# EAGLE design targetboard3 (EAGLE 6.5.0)
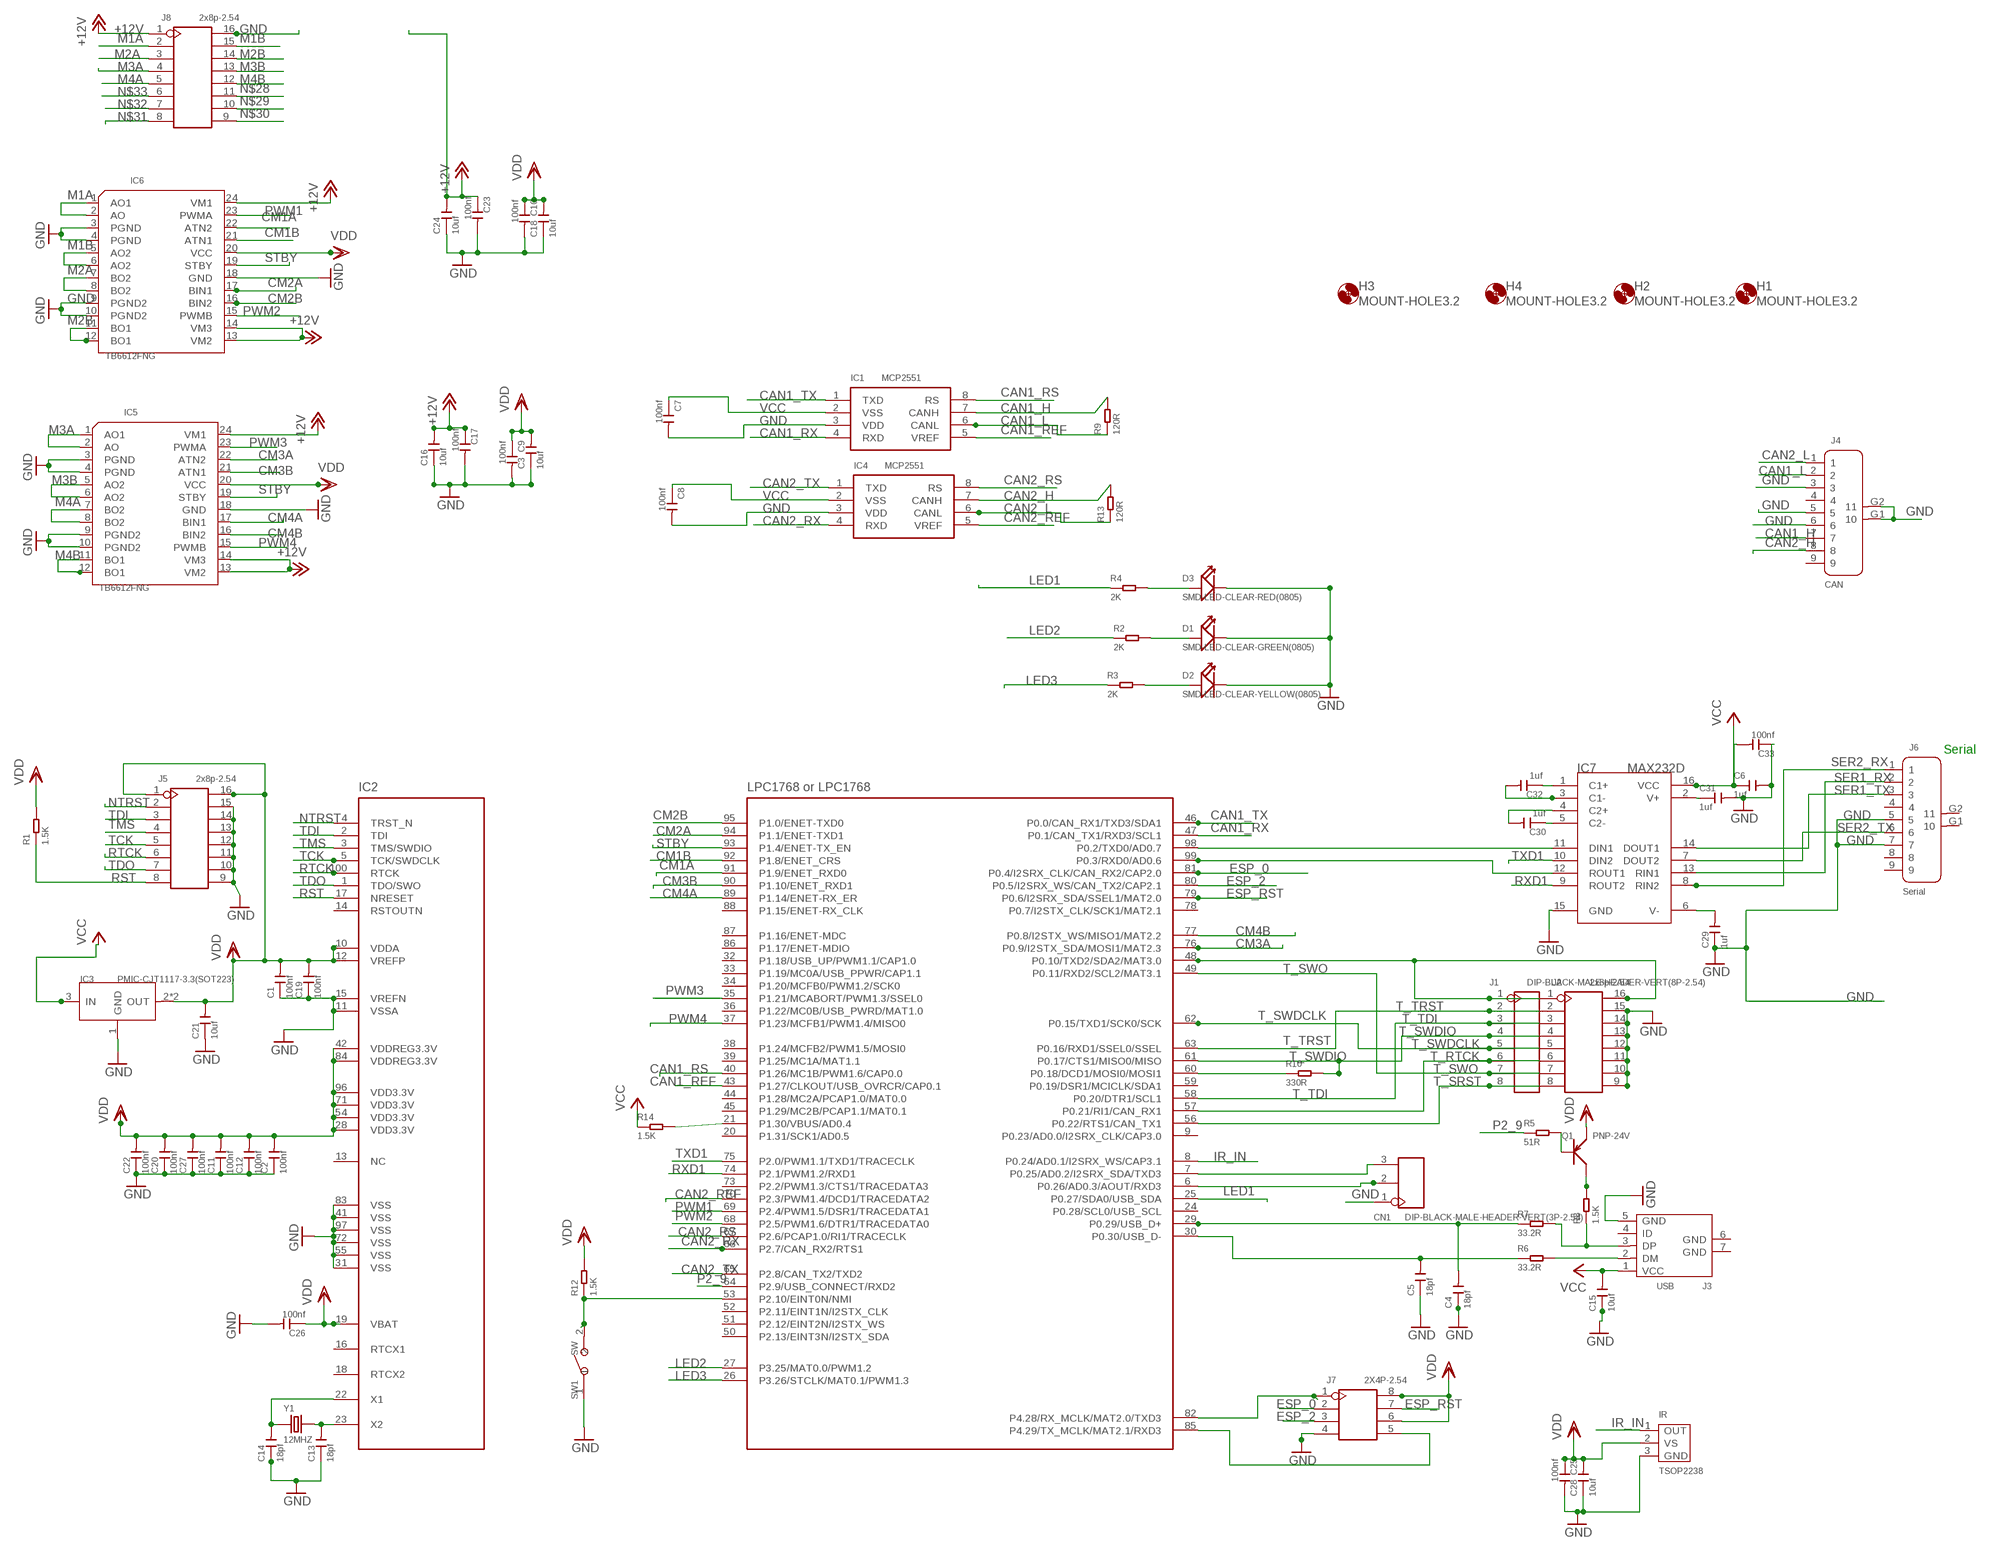
[diagram p0: schematic, sheet 1]

## Parts
C1  100nf  CERAMIC-100NF-50V-10%-X7R(0805)  [C0805]
C2  100nf  CERAMIC-100NF-50V-10%-X7R(0805)  [C0805]
C3  10uf  CERAMIC-10UF-25V-10%-X5R(0805)  [C0805]
C4  18pf  CERAMIC-18PF-50V-5%-NPO(0805)  [C0805]
C5  18pf  CERAMIC-18PF-50V-5%-NPO(0805)  [C0805]
C6  1uf  CERAMIC-1UF-25V-10%-X7R(0805)  [C0805]
C7  100nf  CERAMIC-100NF-50V-10%-X7R(0805)  [C0805]
C8  100nf  CERAMIC-100NF-50V-10%-X7R(0805)  [C0805]
C9  100nf  CERAMIC-100NF-50V-10%-X7R(0805)  [C0805]
C10  100nf  CERAMIC-100NF-50V-10%-X7R(0805)  [C0805]
C11  100nf  CERAMIC-100NF-50V-10%-X7R(0805)  [C0805]
C12  100nf  CERAMIC-100NF-50V-10%-X7R(0805)  [C0805]
C13  18pf  CERAMIC-18PF-50V-5%-NPO(0805)  [C0805]
C14  18pf  CERAMIC-18PF-50V-5%-NPO(0805)  [C0805]
C15  10uf  CERAMIC-10UF-10V-10%-X5R(0603)  [C0603]
C16  10uf  CERAMIC-10UF-25V-10%-X5R(0805)  [C0805]
C17  100nf  CERAMIC-100NF-50V-10%-X7R(0805)  [C0805]
C18  10uf  CERAMIC-10UF-25V-10%-X5R(0805)  [C0805]
C19  100nf  CERAMIC-100NF-50V-10%-X7R(0805)  [C0805]
C20  100nf  CERAMIC-100NF-50V-10%-X7R(0805)  [C0805]
C21  10uf  CERAMIC-10UF-25V-10%-X5R(0805)  [C0805]
C22  100nf  CERAMIC-100NF-50V-10%-X7R(0805)  [C0805]
C23  100nf  CERAMIC-100NF-50V-10%-X7R(0805)  [C0805]
C24  10uf  CERAMIC-10UF-25V-10%-X5R(0805)  [C0805]
C25  100nf  CERAMIC-100NF-50V-10%-X7R(0805)  [C0805]
C26  100nf  CERAMIC-100NF-50V-10%-X7R(0805)  [C0805]
C27  100nf  CERAMIC-100NF-50V-10%-X7R(0805)  [C0805]
C28  10uf  CERAMIC-10UF-25V-10%-X5R(0805)  [C0805]
C29  1uf  CERAMIC-1UF-25V-10%-X7R(0805)  [C0805]
C30  1uf  CERAMIC-1UF-25V-10%-X7R(0805)  [C0805]
C31  1uf  CERAMIC-1UF-25V-10%-X7R(0805)  [C0805]
C32  1uf  CERAMIC-1UF-25V-10%-X7R(0805)  [C0805]
C33  100nf  CERAMIC-100NF-50V-10%-X7R(0805)  [C0805]
CN1  DIP-BLACK-MALE-HEADER-VERT(3P-2.54)  [H3-2.54]
D1  SMD-LED-CLEAR-GREEN(0805)  [LED-0805]
D2  SMD-LED-CLEAR-YELLOW(0805)  [LED-0805]
D3  SMD-LED-CLEAR-RED(0805)  [LED-0805]
H1  MOUNT-HOLE3.2  [3,2]
H2  MOUNT-HOLE3.2  [3,2]
H3  MOUNT-HOLE3.2  [3,2]
H4  MOUNT-HOLE3.2  [3,2]
IC1  MCP2551  INTERFACE-MCP2551-I/SN(SOIC8)  [SOIC8-1.27-5X4MM]
IC2  LPC1768 or LPC1768  MCU_LPC1768FBD100(LQFP100)  [LQFP100-0.5-13.8X13.8MM]
IC3  PMIC-CJT1117-3.3(SOT223)  [SOT-223]
IC4  MCP2551  INTERFACE-MCP2551-I/SN(SOIC8)  [SOIC8-1.27-5X4MM]
IC5  TB6612FNG  DRIVER-TB6612FNG-O/C8/EL(SSOP24)  [SSOP24-0.65-8.9X5.3MM]
IC6  TB6612FNG  DRIVER-TB6612FNG-O/C8/EL(SSOP24)  [SSOP24-0.65-8.9X5.3MM]
IC7  MAX232D  RECEIVER-MAX232D(SOIC16)  [SOIC16-1.27-10X3.9MM]
IR  TSOP2238  OPTICAL-TSOP2238  [SNR3-2.54-6.95X6.0X5.6MM]
J1  DIP-BLACK-MALE-HEADER-VERT(8P-2.54)  [H8-2.54]
J2  2x8p-2.54  DIP-BLACK-MALE-HEADER-VERT(2X8P-2.54)  [H2X8-2.54]
J3  USB  MICRO-USB-SMD-TYPE-AB-R/A(ST-USB-001L)  [MICRO-USB5+2P-SMD-0.65]
J4  CAN  DIP-MALE-DB9-CONNECTOR  [DSUB9+2P-2.77-90D-MALE]
J5  2x8p-2.54  DIP-BLACK-MALE-HEADER-VERT(2X8P-2.54)  [H2X8-2.54]
J6  Serial  DIP-MALE-DB9-CONNECTOR  [DSUB9+2P-2.77-90D-MALE]
J7  2X4P-2.54  DIP-BLACK-FEMALE-HEADER(2X4P-2.54)  [H2X4-2.54]
J8  2x8p-2.54  DIP-BLACK-MALE-HEADER-VERT(2X8P-2.54)  [H2X8-2.54]
Q1  PNP-24V  SMD-TRANSISTORS-PNP-25V-500MA(SOT-23)  [SOT-23]
R1  1.5K  SMD-RES-1.5K-1%-1/8W(0805)  [R0805]
R2  2K  SMD-RES-2K-5%-1/8W(0805)  [R0805]
R3  2K  SMD-RES-2K-5%-1/8W(0805)  [R0805]
R4  2K  SMD-RES-2K-5%-1/8W(0805)  [R0805]
R5  51R  SMD-RES-51R-1%-1/10W(0603)  [R0603]
R6  33.2R  SMD-RES-33.2R-1%-1/10W(0603)  [R0603]
R7  33.2R  SMD-RES-33.2R-1%-1/10W(0603)  [R0603]
R8  1.5K  SMD-RES-1.5K-1%-1/8W(0805)  [R0805]
R9  120R  SMD-RES-120R-5%-1/8W(0805)  [R0805]
R10  330R  SMD-RES-330R-1%-1/10W(0603)  [R0603]
R12  1.5K  SMD-RES-1.5K-1%-1/8W(0805)  [R0805]
R13  120R  SMD-RES-120R-5%-1/8W(0805)  [R0805]
R14  1.5K  SMD-RES-1.5K-1%-1/8W(0805)  [R0805]
SW1  SW  SMD-BUTTON(2P-3.0X2.5X1.2+0.4MM)-B3U-1000P-2P-SMD  [SW2-2.6-3.0X2.5X1.2+0.4MM]
Y1  12MHZ  SMD-CRYSTAL-12MHZ-20PF-20PPM-40R(2P-5.0X3.2MM)  [X2-SMD-5.0X3.2X1.3MM]

## Nets
+12V: C16.2 C17.1 C23.1 C24.2 IC5.13(VM2) IC5.14(VM3) IC5.24(VM1) IC6.13(VM2) IC6.14(VM3) IC6.24(VM1) J8.1
CAN1_H: IC1.7(CANH) J4.7 R9.2
CAN1_L: IC1.6(CANL) J4.2 R9.1
CAN1_REF: IC1.5(VREF) IC2.43(P1.27/CLKOUT/USB_OVRCR/CAP0.1)
CAN1_RS: IC1.8(RS) IC2.40(P1.26/MC1B/PWM1.6/CAP0.0)
CAN1_RX: IC1.4(RXD) IC2.47(P0.1/CAN_TX1/RXD3/SCL1)
CAN1_TX: IC1.1(TXD) IC2.46(P0.0/CAN_RX1/TXD3/SDA1)
CAN2_H: IC4.7(CANH) J4.8 R13.2
CAN2_L: IC4.6(CANL) J4.1 R13.1
CAN2_REF: IC2.70(P2.3/PWM1.4/DCD1/TRACEDATA2) IC4.5(VREF)
CAN2_RS: IC2.67(P2.6/PCAP1.0/RI1/TRACECLK) IC4.8(RS)
CAN2_RX: IC2.66(P2.7/CAN_RX2/RTS1) IC4.4(RXD)
CAN2_TX: IC2.65(P2.8/CAN_TX2/TXD2) IC4.1(TXD)
CM1A: IC2.91(P1.9/ENET_RXD0) IC6.22(ATN2)
CM1B: IC2.92(P1.8/ENET_CRS) IC6.21(ATN1)
CM2A: IC2.94(P1.1/ENET-TXD1) IC6.17(BIN1)
CM2B: IC2.95(P1.0/ENET-TXD0) IC6.16(BIN2)
CM3A: IC2.76(P0.9/I2STX_SDA/MOSI1/MAT2.3) IC5.22(ATN2)
CM3B: IC2.90(P1.10/ENET_RXD1) IC5.21(ATN1)
CM4A: IC2.89(P1.14/ENET-RX_ER) IC5.17(BIN1)
CM4B: IC2.77(P0.8/I2STX_WS/MISO1/MAT2.2) IC5.16(BIN2)
DM: J3.2(DM) R6.2
DP: J3.3(DP) R7.2 R8.1
EDM: C5.2 IC2.30(P0.30/USB_D-) R6.1
EDP: C4.2 IC2.29(P0.29/USB_D+) R7.1
ESP_0: IC2.81(P0.4/I2SRX_CLK/CAN_RX2/CAP2.0) J7.2
ESP_2: IC2.80(P0.5/I2SRX_WS/CAN_TX2/CAP2.1) J7.3
ESP_RST: IC2.79(P0.6/I2SRX_SDA/SSEL1/MAT2.0) J7.7
GND: C1.1 C2.1 C3.1 C4.1 C5.1 C6.2 C7.2 C8.2 C9.2 C10.2 C11.1 C12.1 C13.1 C14.1 C15.1 C16.1 C17.2 C18.1 C19.1 C20.1 C21.1 C22.1 C23.2 C24.1 C25.2 C26.2 C27.1 C28.1 C29.1 C31.2 C33.1 CN1.1 D1.- D2.- D3.- IC1.3(VDD) IC2.11(VSSA) IC2.15(VREFN) IC2.31(VSS) IC2.41(VSS) IC2.55(VSS) IC2.72(VSS) IC2.83(VSS) IC2.97(VSS) IC3.1(GND) IC4.3(VDD) IC5.3(PGND) IC5.4(PGND) IC5.9(PGND2) IC5.10(PGND2) IC5.18(GND) IC6.3(PGND) IC6.4(PGND) IC6.9(PGND2) IC6.10(PGND2) IC6.18(GND) IC7.15(GND) IR.3(GND) J2.9 J2.10 J2.11 J2.12 J2.13 J2.14 J2.15 J3.5(GND) J4.3 J4.5 J4.6 J4.G1 J4.G2 J5.9 J5.10 J5.11 J5.12 J5.13 J5.14 J5.15 J6.5 J6.7 J7.4 J8.16 SW1.1
IR_IN: IC2.8(P0.24/AD0.1/I2SRX_WS/CAP3.1) IR.1(OUT)
LED1: IC2.25(P0.27/SDA0/USB_SDA) R4.1
LED2: IC2.27(P3.25/MAT0.0/PWM1.2) R2.1
LED3: IC2.26(P3.26/STCLK/MAT0.1/PWM1.3) R3.1
M1A: IC6.1(AO1) IC6.2(AO) J8.2
M1B: IC6.5(AO2) IC6.6(AO2) J8.15
M2A: IC6.7(BO2) IC6.8(BO2) J8.3
M2B: IC6.11(BO1) IC6.12(BO1) J8.14
M3A: IC5.1(AO1) IC5.2(AO) J8.4
M3B: IC5.5(AO2) IC5.6(AO2) J8.13
M4A: IC5.7(BO2) IC5.8(BO2) J8.5
M4B: IC5.11(BO1) IC5.12(BO1) J8.12
N$1: IC2.48(P0.10/TXD2/SDA2/MAT3.0) J1.1 J2.1 J2.16
N$2: IC2.53(P2.10/EINT0N/NMI) R12.1 SW1.2
N$3: D2.+ R3.2
N$4: D1.+ R2.2
N$5: D3.+ R4.2
N$6: C14.2 IC2.22(X1) Y1.1
N$7: Q1.3(C) R8.2
N$8: C13.2 IC2.23(X2) Y1.2
N$9: Q1.1(B) R5.2
N$10: IC2.21(P1.30/VBUS/AD0.4) R14.2
N$11: IC2.85(P4.29/TX_MCLK/MAT2.1/RXD3) J7.5
N$12: IC2.98(P0.2/TXD0/AD0.7) IC7.11(DIN1)
N$13: IC2.99(P0.3/RXD0/AD0.6) IC7.12(ROUT1)
N$15: C30.2 IC7.4(C2+)
N$16: C30.1 IC7.5(C2-)
N$17: C32.1 IC7.1(C1+)
N$18: C32.2 IC7.3(C1-)
N$19: C29.2 IC7.6(V-)
N$20: C31.1 IC7.2(V+)
N$22: IC2.60(P0.18/DCD1/MOSI0/MOSI1) R10.1
N$23: IC2.82(P4.28/RX_MCLK/MAT2.0/TXD3) J7.1
N$28: J8.11
N$29: J8.10
N$30: J8.9
N$31: J8.8
N$32: J8.7
N$33: J8.6
NTRST: IC2.4(TRST_N) J5.2
P2_9: IC2.64(P2.9/USB_CONNECT/RXD2) R5.1
PWM1: IC2.69(P2.4/PWM1.5/DSR1/TRACEDATA1) IC6.23(PWMA)
PWM2: IC2.68(P2.5/PWM1.6/DTR1/TRACEDATA0) IC6.15(PWMB)
PWM3: IC2.35(P1.21/MCABORT/PWM1.3/SSEL0) IC5.23(PWMA)
PWM4: IC2.37(P1.23/MCFB1/PWM1.4/MISO0) IC5.15(PWMB)
RST: IC2.17(NRESET) J5.8 R1.1
RTCK: IC2.100(RTCK) J5.6
RX3: CN1.2 IC2.6(P0.26/AD0.3/AOUT/RXD3)
RXD1: IC2.74(P2.1/PWM1.2/RXD1) IC7.9(ROUT2)
SER1_RX: IC7.13(RIN1) J6.2
SER1_TX: IC7.14(DOUT1) J6.3
SER2_RX: IC7.8(RIN2) J6.1
SER2_TX: IC7.7(DOUT2) J6.6
STBY: IC2.93(P1.4/ENET-TX_EN) IC5.19(STBY) IC6.19(STBY)
T_RTCK: IC2.57(P0.21/RI1/CAN_RX1) J1.6 J2.6
T_SRST: IC2.56(P0.22/RTS1/CAN_TX1) J1.8 J2.8
T_SWDCLK: IC2.62(P0.15/TXD1/SCK0/SCK) J1.5 J2.5
T_SWDIO: IC2.61(P0.17/CTS1/MISO0/MISO) J1.4 J2.4 R10.2
T_SWO: IC2.49(P0.11/RXD2/SCL2/MAT3.1) J1.7 J2.7
T_TDI: IC2.58(P0.20/DTR1/SCL1) J1.3 J2.3
T_TRST: IC2.63(P0.16/RXD1/SSEL0/SSEL) J1.2 J2.2
TCK: IC2.5(TCK/SWDCLK) J5.5
TDI: IC2.2(TDI) J5.3
TDO: IC2.1(TDO/SWO) J5.7
TMS: IC2.3(TMS/SWDIO) J5.4
TX3: CN1.3 IC2.7(P0.25/AD0.2/I2SRX_SDA/TXD3)
TXD1: IC2.75(P2.0/PWM1.1/TXD1/TRACECLK) IC7.10(DIN2)
VCC: C6.1 C7.1 C8.1 C15.2 C33.2 IC1.2(VSS) IC3.3(IN) IC4.2(VSS) IC7.16(VCC) J3.1(VCC) R14.1
VDD: C1.2 C2.2 C3.2 C9.1 C10.1 C11.2 C12.2 C18.2 C19.2 C20.2 C21.2 C22.2 C25.1 C26.1 C27.2 C28.2 IC2.10(VDDA) IC2.12(VREFP) IC2.19(VBAT) IC2.28(VDD3.3V) IC2.42(VDDREG3.3V) IC2.54(VDD3.3V) IC2.71(VDD3.3V) IC2.84(VDDREG3.3V) IC2.96(VDD3.3V) IC3.2(OUT) IC3.TER(OUT) IC5.20(VCC) IC6.20(VCC) IR.2(VS) J5.1 J5.16 J7.6 J7.8 Q1.2(E) R1.2 R12.2
Unconnected: IC2.9(P0.23/AD0.0/I2SRX_CLK/CAP3.0) IC2.13(NC) IC2.14(RSTOUTN) IC2.16(RTCX1) IC2.18(RTCX2) IC2.20(P1.31/SCK1/AD0.5) IC2.24(P0.28/SCL0/USB_SCL) IC2.32(P1.18/USB_UP/PWM1.1/CAP1.0) IC2.33(P1.19/MC0A/USB_PPWR/CAP1.1) IC2.34(P1.20/MCFB0/PWM1.2/SCK0) IC2.36(P1.22/MC0B/USB_PWRD/MAT1.0) IC2.38(P1.24/MCFB2/PWM1.5/MOSI0) IC2.39(P1.25/MC1A/MAT1.1) IC2.44(P1.28/MC2A/PCAP1.0/MAT0.0) IC2.45(P1.29/MC2B/PCAP1.1/MAT0.1) IC2.50(P2.13/EINT3N/I2STX_SDA) IC2.51(P2.12/EINT2N/I2STX_WS) IC2.52(P2.11/EINT1N/I2STX_CLK) IC2.59(P0.19/DSR1/MCICLK/SDA1) IC2.73(P2.2/PWM1.3/CTS1/TRACEDATA3) IC2.78(P0.7/I2STX_CLK/SCK1/MAT2.1) IC2.86(P1.17/ENET-MDIO) IC2.87(P1.16/ENET-MDC) IC2.88(P1.15/ENET-RX_CLK) J3.4(ID) J3.6(GND) J3.7(GND) J4.4 J4.9 J6.4 J6.8 J6.9 J6.G1 J6.G2

## Notes on the sheet
- Serial

## Library data of the parts
C1 C2 C7-C12 C17 C19 C20 C22 C23 C25-C27 C33 = Seeed-OPL-Capacitor:CERAMIC-100NF-50V-10%-X7R(0805): 302010165; MPN: CC0805KRX7R9BB104
C3 C16 C18 C21 C24 C28 = Seeed-OPL-Capacitor:CERAMIC-10UF-25V-10%-X5R(0805): 302010178; MPN: CC0805KKX5R8BB106
C4 C5 C13 C14 = Seeed-OPL-Capacitor:CERAMIC-18PF-50V-5%-NPO(0805): 302010162
C6 C29-C32 = Seeed-OPL-Capacitor:CERAMIC-1UF-25V-10%-X7R(0805): 302010179; MPN: CC0805KKX7R8BB105
C15 = Seeed-OPL-Capacitor:CERAMIC-10UF-10V-10%-X5R(0603): 302010103; MPN: CC0603KRX5R6BB106
CN1 = Seeed-OPL-Connector:DIP-BLACK-MALE-HEADER-VERT(3P-2.54): 320020079
D1 = Seeed-OPL-Diode:SMD-LED-CLEAR-GREEN(0805): 304090057; MPN: 17-215SYGC/S530-E2/TR8
D2 = Seeed-OPL-Diode:SMD-LED-CLEAR-YELLOW(0805): 304090039; MPN: 17-215UYC/S530-A3/TR8
D3 = Seeed-OPL-Diode:SMD-LED-CLEAR-RED(0805): 304090046; MPN: 17-215SURC/S530-A2/TR8
H1-H4 = holes:MOUNT-HOLE: MOUNTING HOLE with drill center marker
IC1 IC4 = Seeed-OPL-ic:INTERFACE-MCP2551-I/SN(SOIC8): 310070024; MPN: MCP2551-I/SN
IC2 = Seeed-OPL-ic:MCU_LPC1768FBD100(LQFP100): 310010001; MPN: LPC1768FBD100
IC3 = Seeed-OPL-ic:PMIC-CJT1117-3.3(SOT223): 310030097; MPN: CJT1117-3.3
IC5 IC6 = Seeed-OPL-ic:DRIVER-TB6612FNG-O/C8/EL(SSOP24): 310040007; MPN: TB6612FNG-O/C8/EL
IC7 = Seeed-OPL-ic:RECEIVER-MAX232D(SOIC16): 310060023; MPN: MAX232D
IR = Seeed-OPL-sensor:OPTICAL-TSOP2238: 314020045
J1 = Seeed-OPL-Connector:DIP-BLACK-MALE-HEADER-VERT(8P-2.54): 320020080; MPN: P125-1108A1BS116A1
J2 J5 J8 = Seeed-OPL-Connector:DIP-BLACK-MALE-HEADER-VERT(2X8P-2.54): 320020045; MPN: P125-1216A0AS116A1
J3 = Seeed-OPL-Connector:MICRO-USB-SMD-TYPE-AB-R/A(ST-USB-001L): 320010012; MPN: ST-USB-001L
J4 J6 = Seeed-OPL-Connector:DIP-MALE-DB9-CONNECTOR: 320110017
J7 = Seeed-OPL-Connector:DIP-BLACK-FEMALE-HEADER(2X4P-2.54): 320030087
Q1 = Seeed-OPL-Transistor:SMD-TRANSISTORS-PNP-25V-500MA(SOT-23): 305020006; MPN: S8550
R1 R8 R12 R14 = Seeed-OPL-Resistor:SMD-RES-1.5K-1%-1/8W(0805): 301010394; MPN: RC0805FR-071K5L
R2-R4 = Seeed-OPL-Resistor:SMD-RES-2K-5%-1/8W(0805): 301010318; MPN: RC0805JR-072KL
R5 = Seeed-OPL-Resistor:SMD-RES-51R-1%-1/10W(0603): 301010225; MPN: RC0603FR-0751RL
R6 R7 = Seeed-OPL-Resistor:SMD-RES-33.2R-1%-1/10W(0603): 301010687; MPN: RC0603FR-0733R2L
R9 R13 = Seeed-OPL-Resistor:SMD-RES-120R-5%-1/8W(0805): 301010351; MPN: RC0805JR-07120RL
R10 = Seeed-OPL-Resistor:SMD-RES-330R-1%-1/10W(0603): 301010300; MPN: RC0603FR-07330RL
SW1 = Seeed-OPL-Switch:SMD-BUTTON(2P-3.0X2.5X1.2+0.4MM): 311020047
Y1 = Seeed-OPL-crystal-osctllator:SMD-CRYSTAL-12MHZ-20PF-20PPM-40R(2P-5.0X3.2MM): 306010047; MPN: 5032/2P

## Board
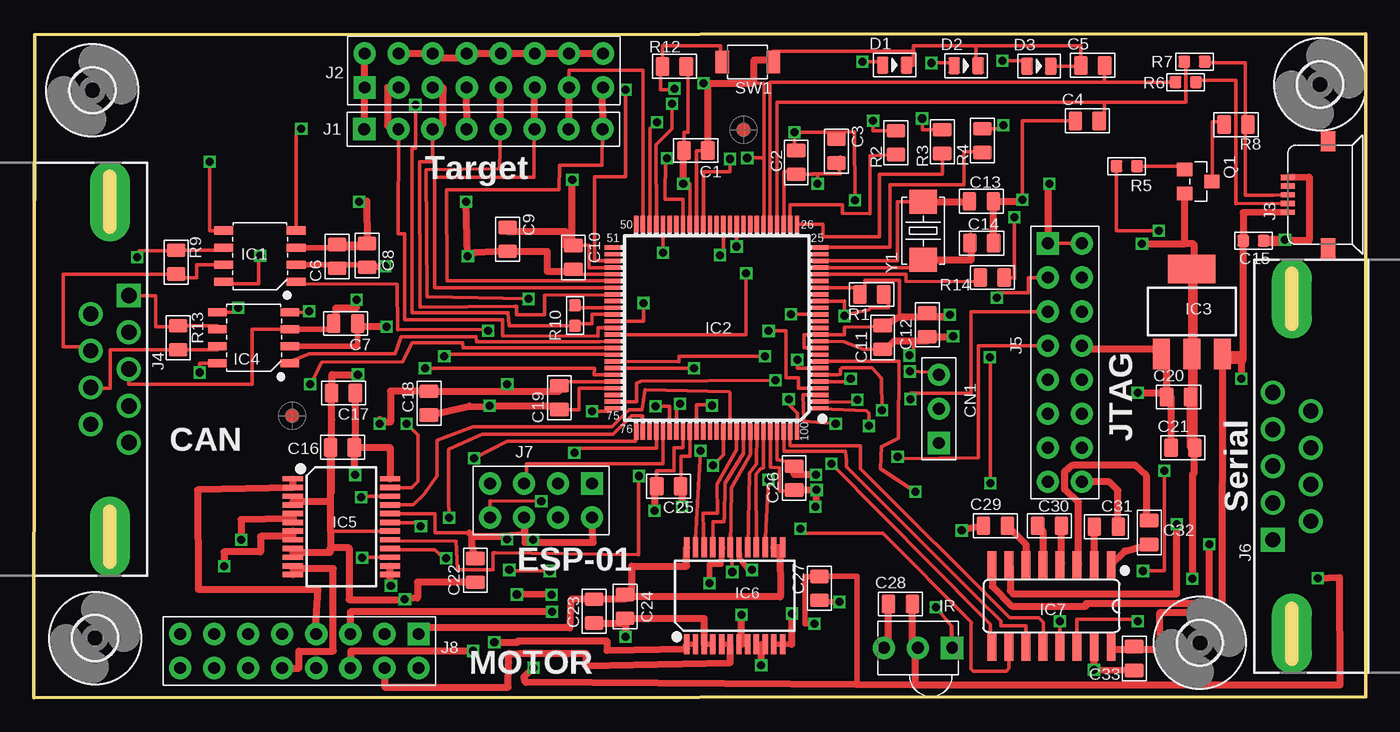
[diagram p1: board, top side]
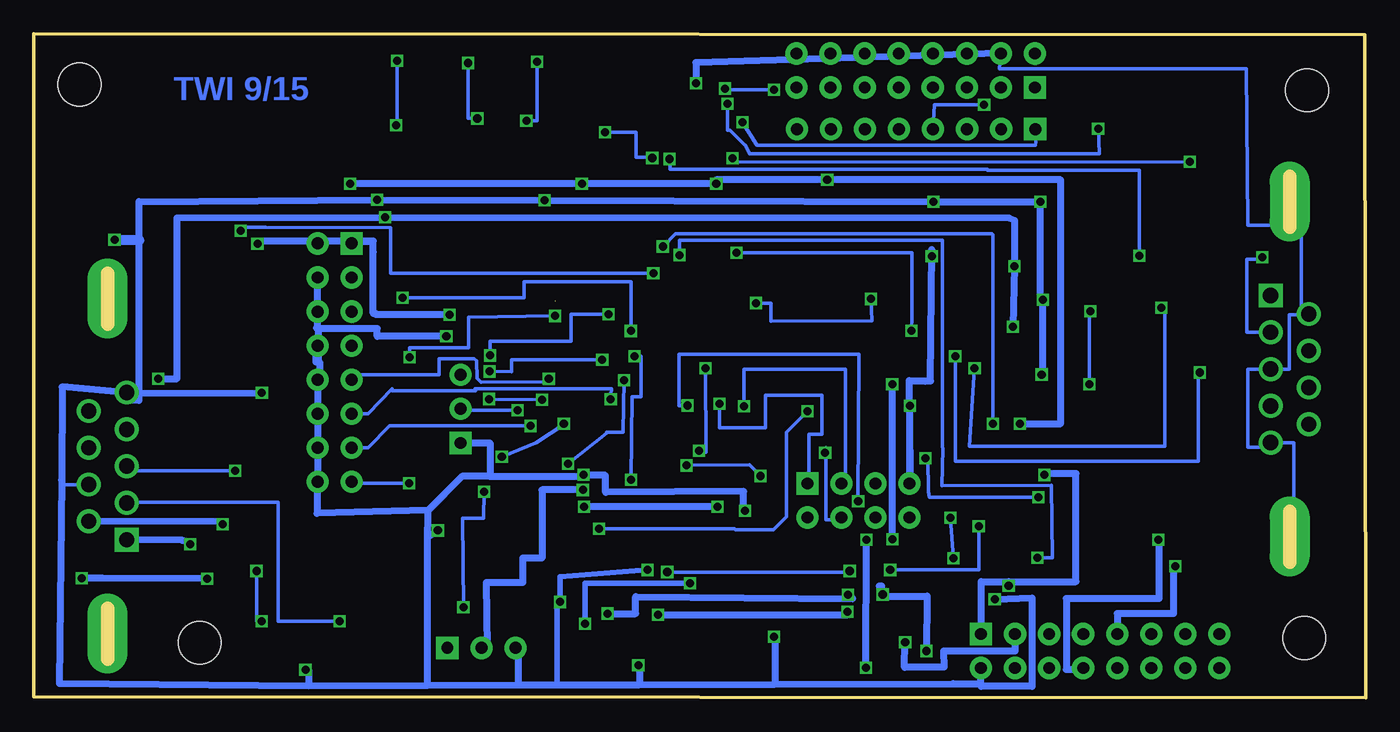
[diagram p2: board, bottom side, seen from below]

Size 99.44 x 49.57 mm. Coordinates in mm from the lower left corner, seen from the top.
Outline: 0,0 99.44,0.08 99.44,49.57 0.1,49.47 0,0
Copper layers (1*16): Top 0.035mm / dielectric 1.5mm / Bottom 0.035mm
Design rules "SeeedStudio_2layer_DRU_no_angle_20140221 *": minimum track width 6mil, minimum drill 12mil, track to track 7mil, track to pad 7mil, pad to pad 7mil, via to via 7mil, smd to smd 0mil, copper to edge 10mil, drill to drill 10mil, minimum pad ring 10mil, minimum via ring 6mil, stop-mask expansion 2mil, vias tented up to drill 100mil, thermal gap 10mil

### Footprints (pad centres in the part's own frame; a part is rotated, then mirrored left to right if it is on the bottom)
C0805 = smd 1.397 x 1.016: 1 0,0.889; 2 0,-0.889
C0603 = smd 0.889 x 0.889: 1 0,0.762; 2 0,-0.762
H3-2.54 = drill 0.889 pad 1.651 square: 1 0,2.54 | drill 0.889 pad 1.651: 2 0,0; 3 0,-2.54
LED-0805 = smd 0.889 x 1.27: + -0.889,0; - 0.889,0
3,2 = hole 3.2: 0,0
SOIC8-1.27-5X4MM = smd 0.6 x 1.4: 1 -1.905,-2.7; 2 -0.635,-2.7; 3 0.635,-2.7; 4 1.905,-2.7; 5 1.905,2.7; 6 0.635,2.7; 7 -0.635,2.7; 8 -1.905,2.7
LQFP100-0.5-13.8X13.8MM = smd 1.2 x 0.32: 1 -7.75,6; 2 -7.75,5.5; 3 -7.75,5; 4 -7.75,4.5; 5 -7.75,4; 6 -7.75,3.5; 7 -7.75,3; 8 -7.75,2.5; 9 -7.75,2; 10 -7.75,1.5; 11 -7.75,1; 12 -7.75,0.5; 13 -7.75,0; 14 -7.75,-0.5; 15 -7.75,-1; 16 -7.75,-1.5; 17 -7.75,-2; 18 -7.75,-2.5; 19 -7.75,-3; 20 -7.75,-3.5; 21 -7.75,-4; 22 -7.75,-4.5; 23 -7.75,-5; 24 -7.75,-5.5; 25 -7.75,-6; 51 7.75,-6; 52 7.75,-5.5; 53 7.75,-5; 54 7.75,-4.5; 55 7.75,-4; 56 7.75,-3.5; 57 7.75,-3; 58 7.75,-2.5; 59 7.75,-2; 60 7.75,-1.5; 61 7.75,-1; 62 7.75,-0.5; 63 7.75,0; 64 7.75,0.5; 65 7.75,1; 66 7.75,1.5; 67 7.75,2; 68 7.75,2.5; 69 7.75,3; 70 7.75,3.5; 71 7.75,4; 72 7.75,4.5; 73 7.75,5; 74 7.75,5.5; 75 7.75,6 | smd 0.32 x 1.2: 26 -6,-7.75; 27 -5.5,-7.75; 28 -5,-7.75; 29 -4.5,-7.75; 30 -4,-7.75; 31 -3.5,-7.75; 32 -3,-7.75; 33 -2.5,-7.75; 34 -2,-7.75; 35 -1.5,-7.75; 36 -1,-7.75; 37 -0.5,-7.75; 38 0,-7.75; 39 0.5,-7.75; 40 1,-7.75; 41 1.5,-7.75; 42 2,-7.75; 43 2.5,-7.75; 44 3,-7.75; 45 3.5,-7.75; 46 4,-7.75; 47 4.5,-7.75; 48 5,-7.75; 49 5.5,-7.75; 50 6,-7.75; 76 6,7.75; 77 5.5,7.75; 78 5,7.75; 79 4.5,7.75; 80 4,7.75; 81 3.5,7.75; 82 3,7.75; 83 2.5,7.75; 84 2,7.75; 85 1.5,7.75; 86 1,7.75; 87 0.5,7.75; 88 0,7.75; 89 -0.5,7.75; 90 -1,7.75; 91 -1.5,7.75; 92 -2,7.75; 93 -2.5,7.75; 94 -3,7.75; 95 -3.5,7.75; 96 -4,7.75; 97 -4.5,7.75; 98 -5,7.75; 99 -5.5,7.75; 100 -6,7.75
SOT-223 = smd 1.27 x 2.286: 1 -2.286,-3.175; 2 0,-3.175; 3 2.286,-3.175 | smd 3.556 x 2.159: TER 0,3.175
SSOP24-0.65-8.9X5.3MM = smd 0.4 x 1.5: 1 -3.575,-3.625; 2 -2.925,-3.625; 3 -2.275,-3.625; 4 -1.625,-3.625; 5 -0.975,-3.625; 6 -0.325,-3.625; 7 0.325,-3.625; 8 0.975,-3.625; 9 1.625,-3.625; 10 2.275,-3.625; 11 2.925,-3.625; 12 3.575,-3.625; 13 3.575,3.625; 14 2.925,3.625; 15 2.275,3.625; 16 1.625,3.625; 17 0.975,3.625; 18 0.325,3.625; 19 -0.325,3.625; 20 -0.975,3.625; 21 -1.625,3.625; 22 -2.275,3.625; 23 -2.925,3.625; 24 -3.575,3.625
SOIC16-1.27-10X3.9MM = smd 0.66 x 2.032: 1 -4.445,-3.073; 2 -3.175,-3.073; 3 -1.905,-3.073; 4 -0.635,-3.073; 5 0.635,-3.073; 6 1.905,-3.073; 7 3.175,-3.073; 8 4.445,-3.073; 9 4.445,3.073; 10 3.175,3.073; 11 1.905,3.073; 12 0.635,3.073; 13 -0.635,3.073; 14 -1.905,3.073; 15 -3.175,3.073; 16 -4.445,3.073
SNR3-2.54-6.95X6.0X5.6MM = drill 0.889 pad 1.651 square: 1 0,2.54 | drill 0.889 pad 1.651: 2 0,0; 3 0,-2.54
H8-2.54 = drill 0.889 pad 1.651 square: 1 0,8.89 | drill 0.889 pad 1.651: 2 0,6.35; 3 0,3.81; 4 0,1.27; 5 0,-1.27; 6 0,-3.81; 7 0,-6.35; 8 0,-8.89
H2X8-2.54 = drill 0.889 pad 1.651 square: 1 -1.27,8.89 | drill 0.889 pad 1.651: 2 -1.27,6.35; 3 -1.27,3.81; 4 -1.27,1.27; 5 -1.27,-1.27; 6 -1.27,-3.81; 7 -1.27,-6.35; 8 -1.27,-8.89; 9 1.27,-8.89; 10 1.27,-6.35; 11 1.27,-3.81; 12 1.27,-1.27; 13 1.27,1.27; 14 1.27,3.81; 15 1.27,6.35; 16 1.27,8.89
MICRO-USB5+2P-SMD-0.65 = smd 0.4 x 1.05: 1 -1.3,0; 2 -0.65,0; 3 0,0; 4 0.65,0; 5 1.3,0 | smd 1.5 x 1.1: 6 4,-3; 7 -4,-3
DSUB9+2P-2.77-90D-MALE = drill 1.143 pad 1.778 square: 1 -5.486,1.422 | drill 1.143 pad 1.778: 2 -2.743,1.422; 3 0,1.422; 4 2.743,1.422; 5 5.486,1.422; 6 -4.115,-1.422; 7 -1.372,-1.422; 8 1.372,-1.422; 9 4.115,-1.422 | drill 1 pad 3 long: G1 12.497,0; G2 -12.497,0
H2X4-2.54 = drill 0.889 pad 1.651 square: 1 -1.27,3.81 | drill 0.889 pad 1.651: 2 -1.27,1.27; 3 -1.27,-1.27; 4 -1.27,-3.81; 5 1.27,-3.81; 6 1.27,-1.27; 7 1.27,1.27; 8 1.27,3.81
SOT-23 = smd 1.016 x 1.143: 1 -0.889,-1.016; 2 0.889,-1.016; 3 0,1.016
R0805 = smd 1.397 x 1.016: 1 0,0.889; 2 0,-0.889
R0603 = smd 0.889 x 0.889: 1 0,0.762; 2 0,-0.762
SW2-2.6-3.0X2.5X1.2+0.4MM = smd 1 x 1.7: 1 -1.9,0; 2 1.9,0
X2-SMD-5.0X3.2X1.3MM = smd 1.778 x 2.032: 1 -2.159,0; 2 2.159,0

### Placement (x,y rotation side)
C1  49.43,40.84 270 top
C2  56.92,39.95 0 top
C3  59.92,40.79 0 top
C4  78.64,43.05 90 top
C5  79.04,47.19 90 top
C6  22.66,32.94 180 top
C7  23.29,27.94 270 top
C8  24.89,33.02 180 top
C9  35.38,34.21 0 top
C10  40.28,32.87 0 top
C11  63.37,26.9 180 top
C12  66.7,27.84 180 top
C13  70.74,37.06 270 top
C14  70.76,33.93 270 top
C15  91.03,34.11 270 top
C16  23.06,18.69 90 top
C17  23.14,22.76 270 top
C18  29.51,22 180 top
C19  39.24,22.4 180 top
C20  85.45,22.45 90 top
C21  85.78,18.67 90 top
C22  32.97,9.53 180 top
C23  41.83,6.48 0 top
C24  44.15,6.83 180 top
C25  47.4,15.8 270 top
C26  56.77,16.41 180 top
C27  58.65,8.18 180 top
C28  64.69,7.01 90 top
C29  71.78,12.85 90 top
C30  75.82,12.85 90 top
C31  80.06,12.78 90 top
C32  83.26,12.34 180 top
C33  82.14,2.95 180 top
CN1  67.56,21.56 180 top
D1  64.26,47.22 0 top
D2  69.6,47.17 0 top
D3  75.03,47.14 0 top
H1  4.39,45.34 0 top
H2  96.01,45.77 0 top
H3  4.6,4.47 0 top
H4  87.05,4.11 0 top
IC1  16.89,32.97 90 top
IC2  50.98,27.61 180 top
IC3  86.44,28.83 0 top
IC4  16.43,26.87 90 top
IC5  22.99,12.78 270 top
IC6  52.32,7.62 0 top
IC7  75.97,6.86 180 top
IR  66.01,3.73 270 top
J1  33.58,42.44 90 top
J2  33.6,46.81 90 top
J3  93.6,37.54 90 top
J4  5.69,24.54 270 top
J5  76.96,25.02 0 top
J6  93.9,17.3 90 top
J7  37.87,14.73 270 top
J8  19.84,3.51 270 top
Q1  86.92,38.53 270 top
R1  62.56,30.1 270 top
R2  64.36,41.43 180 top
R3  67.82,41.5 180 top
R4  70.82,41.58 180 top
R5  81.58,39.67 90 top
R6  85.98,45.95 90 top
R7  86.64,47.47 90 top
R8  89.74,42.77 270 top
R9  10.64,32.51 0 top
R10  40.41,28.52 0 top
R12  47.83,47.12 90 top
R13  10.79,26.87 0 top
R14  71.55,31.37 270 top
SW1  53.29,47.45 180 top
U$1  [FIDUCIAL_G10]  52.98,42.39 0 top
U$2  [FIDUCIAL_G10]  19.3,21.06 0 top
Y1  66.4,34.85 90 top

### Tracks (layer width: path | path; a pad name or v marks a point on that pad's centre or on a via)
+12V  (via drill 0.6)
  Top 0.152: IC6.13 55.91,11.25 55.7,11.24
  Top 0.406: C23.1 40.56,7.37 40.56,7.39
  Top 0.508: 24,22.76 C17.1 24.03,18.69 | 24.03,18.69 C16.2 23.95,16.64 v24,16.64 | C24.2 44.15,7.39 40.56,7.39 40.16,7.39 40.03,5.23 28.73,5.23 J8.1 | C24.2 44.65,7.72 44.65,9.83 48.75,9.83 IC6.24 | IC6.14 55.7,11.24 55.73,7.54 44.17,7.54 C24.2 | 24.03,18.69 26.61,18.69 IC5.24 | IC5.13 IC5.14 26.61,8.38 v26.67,8.38
  Bottom 0.508: 26.67,8.69 21.64,8.69 21.64,16.74 24,16.74 v24,16.64 | 26.67,8.69 28.73,8.69 J8.1 | 26.67,8.69 v26.67,8.38
CAN1_H
  Top 0.254: IC1.7 12.17,32.33 12.17,31.37 10.64,31.37 R9.2 2.21,31.62 2.21,26.19 4.27,26.19 J4.7
CAN1_L  (via drill 0.6)
  Top 0.254: v7.75,32.87 7.9,32.87 7.9,33.35 10.64,33.35 R9.1 14.19,33.4 IC1.6
  Bottom 0.254: J4.2 8.89,27.28 8.89,32.74 7.75,32.74 v7.75,32.87
CAN1_REF  (via drill 0.6)
  Top 0.254: IC1.5 13.16,34.87 v13.16,40 | v47.27,40.26 47.17,40.28 47.14,37.21 48.45,37.21 IC2.43
  Bottom 0.254: v13.16,40 47.17,39.98 v47.27,40.26
CAN1_RS  (via drill 0.6)
  Top 0.254: IC2.40 49.99,39.27 51.97,39.27 v51.97,40.21 | v16.92,32.99 16.82,32.99 16.82,30.89 14.19,30.89 IC1.8
  Bottom 0.254: v51.97,40.21 51.94,40.21 51.94,39.45 28.27,39.45 28.27,39.37 16.92,39.37 v16.92,32.99
CAN1_RX  (via drill 0.6)
  Top 0.254: IC2.47 46.51,35.36 46.46,41.27 47.65,42.47 v47.65,44.32 | v19.99,42.47 19.59,42.47 IC1.4
  Bottom 0.254: v47.65,44.32 47.65,42.37 47.47,42.37 46.36,41.25 46.3,41.25 46,40.61 19.91,40.61 v19.99,42.47
CAN1_TX  (via drill 0.6)
  Top 0.254: IC2.46 v46.99,33.22 | v33.93,27.41 33.88,27.61 33.93,27.51 27.18,27.48 27.13,30.86 19.59,30.89 IC1.1
  Bottom 0.254: v46.99,33.22 33.88,33.22 33.88,28.02 33.93,27.81 v33.93,27.41
CAN2_H
  Top 0.254: IC4.7 13.73,25.98 R13.2 5.72,25.98 5.72,23.09 4.27,23.09 J4.8
CAN2_L
  Top 0.254: J4.1 9.12,30.02 9.12,27.71 10.8,27.71 R13.1 13.73,27.76 IC4.6
CAN2_REF  (via drill 0.6)
  Top 0.254: IC4.5 15.27,28.78 v15.27,29.11 | v29.21,24.61 41.86,24.61 41.83,24.13 43.2,24.13 IC2.70
  Bottom 0.254: v15.27,29.11 15.01,29.11 15.01,18.77 29.59,18.77 v29.21,24.61
CAN2_RS  (via drill 0.6)
  Top 0.254: IC4.8 12.4,24.97 v12.4,24.28 | v30.66,25.5 31.01,25.76 31.01,25.63 43.23,25.63 IC2.67
  Bottom 0.254: v12.4,24.28 12.5,24.28 12.5,17.65 30.66,17.65 v30.66,25.5
CAN2_RX  (via drill 0.6)
  Top 0.254: IC4.4 20.57,28.78 v20.57,28.85 | v20.65,23.39 20.68,23.39 21.51,25.04 27.56,25.07 28.27,26.52 32,26.52 32.06,26.11 43.28,26.11 IC2.66
  Bottom 0.254: v20.57,28.85 20.65,28.85 v20.65,23.39
CAN2_TX
  Top 0.254: IC4.1 18.52,24.87 20.6,25.68 26.98,25.68 27.43,26.95 33.02,26.95 33.07,26.57 42.29,26.57 IC2.65
CM1A
  Top 0.254: IC6.22 49.97,13.78 51.05,13.77 51,15.95 52.45,18.52 52.48,19.78 IC2.91
CM1B
  Top 0.254: IC6.21 50.7,13.13 51.54,13.13 51.54,13.41 51.56,13.41 51.61,16.03 52.98,18.26 52.98,19.69 IC2.92
CM2A
  Top 0.254: IC6.17 53.31,11.24 53.42,16.76 53.95,17.47 IC2.94
CM2B
  Top 0.254: IC2.95 54.48,17.19 54.23,17.07 53.92,16.69 IC6.16
CM3A  (via drill 0.6)
  Top 0.254: IC5.22 24.46,15.05 v24.46,14.99 | v32.87,17.88 35.36,19.15 44.93,19.15 44.93,19.58 IC2.76
  Bottom 0.254: v24.46,14.99 32.59,14.96 32.66,15.39 32.69,17.88 32.61,17.96 v32.87,17.88
CM3B
  Top 0.254: IC2.90 51.98,22.77 51.92,22.83 45.62,22.99 45.42,21.51 44.45,21.51 43.18,20.24 32.82,20.24 30.12,19.23 30.12,16.59 29.11,15.16 28.35,14.4 IC5.21
CM4A  (via drill 0.6)
  Top 0.254: IC2.89 51.48,18.15 v50.7,17.35 | v45.19,16.56 45.14,16.56 45.14,10.69 34.49,10.85 34.29,10.85 34.29,9.55 31.65,9.55 31.65,9.58 31.55,11.68 26.59,11.73 IC5.17
  Bottom 0.254: v50.7,17.35 46.03,17.4 v45.19,16.56
CM4B  (via drill 0.6)
  Top 0.254: IC2.77 45.47,19.86 45.47,21.06 44.63,21.06 43.23,19.66 33.48,19.66 30.96,18.57 30.96,14.93 v31.01,13.44 | v30.79,10.41 30.25,10.77 29.95,11.07 26.66,11.07 26.66,11.1 IC5.16
  Bottom 0.254: v31.01,13.44 v30.79,10.41
DM
  Top 0.254: J3.2 89.74,36.87 89.74,46.08 86.69,46.08 R6.2
DP
  Top 0.254: J3.3 92.56,37.52 90.45,37.52 90.45,42.06 90.45,42.77 | 90.45,42.77 90.45,47.4 87.4,47.4 R7.2 | R8.1 90.45,42.77
EDM
  Top 0.254: IC2.30 54.98,45.95 R6.1 79.93,45.95 C5.2
EDP
  Top 0.254: R7.1 85.98,47.47 85.98,44.45 79.93,44.45 | 79.93,44.45 55.48,44.45 IC2.29 | C4.2 79.93,43.05 79.93,44.45
ESP_0  (via drill 0.6)
  Top 0.254: v46.41,21.77 47.48,21.77 IC2.81
  Bottom 0.254: J7.2 38.86,16 38.86,24.54 46.41,24.54 v46.41,21.77
ESP_2
  Top 0.254: J7.3 36.8,16 36.8,17.47 46.98,17.47 IC2.80
ESP_RST  (via drill 0.6)
  Top 0.254: IC2.79 46.48,18.64 40.36,18.64 v40.36,18.29
  Bottom 0.254: v40.36,18.29 40.31,18.67 40.31,13.28 39.14,13.28 J7.7
GND  (via drill 0.6)
  Top 0.152: 33.81,21.74 33.81,21.77 v34.04,21.79
  Top 0.254: 91.8,34.09 C15.1 | IC2.97 55.5,19.86 55.47,17.78 56.77,17.55 C26.2 | IC2.83 48.49,18.67 47.8,18.67 47.8,16.94 46.51,16.94 C25.2 | IC4.3 16.31,27.51 16.31,23.42 7.11,23.42 J4.3 | IC2.72 40.72,23.11 40.72,21.49 39.24,21.49 C19.1 | C1.1 49.48,40.84 IC2.41 | IC2.31 54.51,35.36 54.51,45.85 53.77,45.85 53.77,45.87 | 60.22,42.21 v56.79,42.21 56.79,40.84 C2.1 | 60.22,42.21 C3.1 | 60.22,42.21 61.27,42.24 v61.29,37.13 | D1.- 65.66,47.22 | SW1.1 55.19,48.26 65.71,48.26 65.71,47.22 65.66,47.22 | 65.66,47.22 65.66,48.64 70.33,48.64 | 70.33,48.64 78.16,48.64 C5.1 | C5.1 77.93,47.19 77.93,47.22 77.95,47.22 | D3.- 78.16,47.14 C5.1 | C4.1 73.79,43.05 v73.79,37.16 | D2.- 70.33,47.17 70.33,48.64 | IC2.11 60.48,26.59 61.93,26.03 62.84,26.03 63.65,26.06 63.45,26.25 C11.1 | IC2.15 v56.52,28.61 v56.52,28.63 | v65.38,25.55 65.66,25.55 65.66,26.64 | IC5.18 22.17,12.45 | 22.17,18.36 C16.1 | IC5.3 IC5.4 | IC5.10 IC5.9 | C10.2 40.61,31.98 40.61,31.6 43.23,31.6 IC2.55 | v53.26,40.28 54.41,40.28 54.41,40.26
  Top 0.356: 19.36,14.66 IC5.4 | 19.36,10.85 IC5.9
  Top 0.406: IC4.3 22.4,27.51 C7.2 | IC1.3 24.05,33.6 C8.2 | IC6.3 IC6.4 | IC6.9 54.31,3.99 IC6.10 | 44.17,5.59 44.15,5.59 C24.1 | IC6.18 52.68,10.41 53.34,9.55 v53.62,9.55 | v60.15,7.16 58.62,7.16 C27.1
  Top 0.508: J3.5 95.2,38.87 95.2,34.14 91.8,34.09 | C20.1 84.56,25.65 IC3.1 83.79,26.01 77.8,26.01 | C20.1 84.89,22.45 C21.1 | v24.31,37.03 24.87,37.06 C8.2 24.05,33.81 C6.2 | C7.2 22.58,27.94 22.58,29.11 24.1,29.11 v24.1,29.72 | v32.28,37.03 v32.41,32.94 32.84,33.2 C9.2 38.33,33.32 38.33,31.83 40.28,31.83 C10.2 | IR.3 63.81,3.73 C28.1 | C28.1 63.63,7.01 | v50.01,45.87 50.32,45.87 | 50.32,45.87 C1.1 | 50.32,45.87 53.77,45.87 53.77,47.6 55.19,47.6 SW1.1 | C16.1 22.25,18.69 C17.2 | 22.25,20.78 C17.2 | C17.2 22.28,22.76 22.28,24.13 v24.21,24.13 | C18.1 32.52,21.77 33.81,21.74 34.01,21.74 | v34.04,21.79 39.24,21.79 C19.1 | C25.2 46.36,15.8 v46.36,13.97 | v58.39,16.66 56.77,16.66 C26.2 | C29.1 69.29,12.52 v69.27,12.5 | C11.1 63.83,26.24 64.24,26.64 65.66,26.64 66.7,26.64 C12.1 68.63,26.95 v68.63,26.97 | v73.79,37.16 73.79,37.06 C13.1 71.63,33.93 C14.1 | C28.1 63.6,7.01 | C24.1 50.05,5.94 IC6.3 | C23.2 44.17,5.59 v44.17,4.57 | 54.31,3.99 v54.31,2.44 | C31.2 80.92,12.8 80.92,15.49 80.29,16.13 J5.9 | C33.1 79.15,2.03 v79.15,2.11 IC7.15 | 19.36,14.66 22.15,14.66 22.15,15.27 22.2,15.27 22.2,18.36 22.17,18.36 22.17,12.45 22.17,11.2 | 22.17,11.2 22.17,11.15 22.12,11.15 22.12,10.85 19.36,10.85 | v82.4,22.76 84.56,22.76 C20.1 | C22.1 28.65,8.64 28.65,7.47 v27.71,7.37 | 22.17,11.2 23.55,11.2 23.55,7.34 27.43,7.34 27.43,7.42 | J2.15 J2.14 30.25,48.08 30.25,47.78 32.33,47.78 J2.13 J2.12 J2.11 J2.10 J2.9
  Top 0.737: C15.1 93.4,34.11 v93.4,34.19
  Bottom 0.152: IR.3 63.27,3.61 | J4.G1 5.69,12.6 5.46,12.6 5.39,12.7 | 5.69,35.25 J4.G2
  Bottom 0.254: 5.39,12.7 5.39,19.05 J4.5 7.11,18.72 8.81,18.72 8.81,24.54 J4.3 5.74,24.54 5.74,28.57 4.27,28.57 J4.6 4.83,28.65 4.83,35.25 5.69,35.25 8.81,35.25 8.92,46.94 27.36,46.94 J2.15 | v56.52,28.63 59.31,28.63 59.31,26.61 65.38,26.61 v65.38,25.55 | 65.38,16.69 67.46,16.54 | 78.28,13.77 78.23,13.82 | J6.7 97.44,15.93 97.34,16.25 | v56.79,42.21 54.48,42.21 54.48,40.33 53.26,40.33 v53.26,40.28
  Bottom 0.406: v53.62,9.55 60.15,9.04 v60.15,7.16 60.38,7.16 60.38,0.98
  Bottom 0.508: 34.09,23.67 34.01,16.84 J7.4 34.04,16 v34.04,21.79 | 34.09,23.67 32.49,23.65 | 32.49,23.65 32.41,33.45 v32.41,32.94 | J6.5 97.31,23.22 97.34,16.25 97.51,1.09 78.92,0.92 | 78.92,0.92 70.05,0.95 | 70.05,0.95 63.27,0.97 | 63.27,0.97 60.38,0.98 54.23,1 | 54.23,1 44.12,1.03 | 44.12,1.03 30.81,1.07 28.73,1.07 J8.16 28.73,0.86 24.92,0.86 24.92,7.47 v27.71,7.37 | J2.15 50.01,47.4 v50.01,45.87 | v24.21,24.13 24.1,24.13 v24.1,29.72 24.31,29.72 v24.31,37.03 v32.28,37.03 v61.29,37.13 v73.79,37.16 91.57,37.03 91.57,34.09 91.57,22.2 92.35,22.2 J6.5 | 34.09,23.67 32.92,23.64 32.49,23.65 | v46.36,13.97 46.46,13.97 46.46,15.42 56.74,15.34 56.77,16.61 58.42,16.61 v58.39,16.66 58.39,16.54 65.38,16.54 | CN1.1 65.38,19.02 65.38,16.69 65.38,16.54 | 65.38,16.54 67.46,16.54 | 67.46,16.54 70.03,13.94 70.05,11.61 | v69.27,12.5 70.05,11.96 70.05,11.61 | 70.05,11.61 70.05,0.95 | v68.63,26.97 73.79,26.97 73.79,27.56 78.16,27.56 | 78.16,27.56 78.31,27.56 78.31,27.66 78.23,27.66 J5.14 J5.15 | J5.13 78.38,26.29 78.38,25.07 78.16,25.07 | 78.16,25.07 78.16,27.56 | 78.16,25.07 78.11,25.07 78.11,23.11 78.23,23.11 J5.12 J5.11 J5.10 J5.9 78.23,13.82 | 63.6,3.61 63.27,3.61 63.27,0.97 | v44.17,4.57 44.12,4.57 44.12,1.03 | v54.31,2.44 54.23,2.44 54.23,1 | 67.46,16.54 70,14 78.28,13.77 | v79.15,2.11 78.92,2.11 78.92,0.92 | J6.5 82.4,22.73 v82.4,22.76
  Bottom 0.737: v93.4,34.19 91.57,34.19 91.57,34.09
IR_IN  (via drill 0.6)
  Top 0.254: IC2.8 64.57,25.11 64.54,19.38 63.27,18.74 63.2,17.09 v65.81,15.39 | v67.36,6.78 68.5,5.38 68.48,3.91 68.55,5.33 IR.1
  Bottom 0.254: v65.81,15.39 65.86,13.41 67.41,13.41 v67.36,6.78
LED1
  Top 0.254: IC2.25 63.91,33.61 63.91,38.3 69.42,38.3 69.42,40.74 70.82,40.74 R4.1
LED2
  Top 0.254: IC2.27 56.46,35.36 56.46,36.78 60.38,36.78 60.38,36.17 62.41,36.12 62.41,40.46 64.36,40.51 R2.1
LED3
  Top 0.254: IC2.26 58.93,35.36 58.93,34.42 63.14,34.42 63.14,39.06 67.82,39.06 R3.1
M1A  (via drill 0.6)
  Top 0.406: IC6.1 IC6.2
  Top 0.508: v34.39,4.17 36.14,4.17 36.14,4.27 42.8,4.27 42.8,3.56 42.82,3.56 48.75,3.68 IC6.1
  Bottom 0.508: J8.2 26.19,3.5 31.52,3.5 31.5,2.31 34.44,2.29 v34.39,4.17
M1B
  Top 0.406: IC6.5 IC6.6
  Top 0.508: J8.15 26.24,2.23 26.21,0.81 35.43,0.81 35.46,2.64 35.46,3.3 36.35,3.3 36.35,3.33 41.25,3.33 41.25,2.41 41.17,2.41 52,2.64 IC6.6
M2A  (via drill 0.6)
  Top 0.406: IC6.8 52.83,3.99 IC6.7
  Top 0.508: 52.83,3.99 v52.83,6.2 | v38.71,6.43 23.65,6.43 J8.3
  Bottom 0.508: v52.83,6.2 38.71,6.2 v38.71,6.43
M2B  (via drill 0.6)
  Top 0.406: 56.59,3.99 IC6.12 IC6.11
  Top 0.508: 56.59,3.99 v56.59,6.3 | v38.66,7.7 v36.07,7.72 | v32.79,3.5 23.67,3.5 J8.14
  Bottom 0.508: v56.59,6.3 54.51,6.3 54.51,7.57 38.33,7.42 38.3,7.42 v38.66,7.7 | v36.07,7.72 36.32,8.36 36.14,8.36 36.14,7.59 32.77,7.59 v32.79,3.5
M3A
  Top 0.508: IC5.1 IC5.2 12.24,15.52 12.29,8.1 21.21,8.1 21.03,5.31 21.11,5.31 J8.4
M3B  (via drill 0.6)
  Top 0.254: IC5.6 19.38,13.1 19.38,13.36
  Top 0.356: IC5.6 IC5.5
  Top 0.508: 19.36,13.39 19.38,13.39 19.38,13.36 19.08,13.36 15.49,13.3 v15.49,11.81
  Bottom 0.508: v15.49,11.81 15.44,11.81 15.44,7.42 22.38,7.42 22.38,2.13 21.11,2.13 J8.13
M4A  (via drill 0.6)
  Top 0.254: IC5.8 IC5.7
  Top 0.508: IC5.7 19.33,12.06 16.94,12.06 | 16.94,12.06 16.97,11.99 | 16.94,12.06 16.94,10.9 14.22,10.9 v14.22,9.83
  Bottom 0.508: v14.22,9.83 14.38,9.83 14.38,6.3 18.57,6.3 J8.5
M4B
  Top 0.254: IC5.12 IC5.11
  Top 0.508: J8.12 19.81,2.23 19.81,3.5 22.38,3.5 22.38,9.65 19.36,9.65 IC5.12
N$1  (via drill 0.6)
  Top 0.254: IC2.48 46,35.36 46,42.52 46.48,42.85 v46.53,42.95
  Top 0.508: J1.1 24.71,42.85 J2.1 J2.16
  Bottom 0.254: v46.53,42.95 45.44,41.22 24.66,41.22 24.64,41.48 J1.1
N$2  (via drill 0.6)
  Top 0.254: IC2.53 41.88,32.61 41.88,38.89 44.17,38.89 v44.17,45.36 | 47.65,45.47 v47.83,45.47 47.83,45.36 46.79,45.36 46.79,47.12 R12.1 46.94,48.64 51.26,48.64 51.26,47.45 SW1.2
  Top 0.508: 51.39,47.69 SW1.2
  Bottom 0.254: v44.17,45.36 47.83,45.36 v47.83,45.47
N$3  (via drill 0.6)
  Top 0.254: R3.2 66.32,42.39 v66.32,43.23 | v67.01,47.37 68.71,47.37 D2.+
  Bottom 0.254: v66.32,43.23 67.01,43.23 v67.01,47.37
N$4  (via drill 0.6)
  Top 0.254: R2.2 62.66,42.32 v62.66,43.05 | v61.85,47.47 63.37,47.47 D1.+
  Bottom 0.254: v62.66,43.05 61.85,43.05 v61.85,47.47
N$5  (via drill 0.6)
  Top 0.254: R4.2 72.39,42.47 v72.39,42.72 | v72.31,47.55 74.14,47.55 D3.+
  Bottom 0.254: v72.39,42.72 72.31,42.72 v72.31,47.55
N$6
  Top 0.254: IC2.22 66.4,32.11 Y1.1
  Top 0.508: Y1.1 69.98,32.69 69.98,34.44 69.88,34.44 C14.2
N$7
  Top 0.254: Q1.3 87.96,38.53 87.96,42.98 88.85,42.98 R8.2
N$8
  Top 0.254: Y1.2 64.47,37.01 64.47,32.61 IC2.23
  Top 0.508: Y1.2 69.85,37.01 C13.2
N$9
  Top 0.254: R5.2 85.9,39.67 Q1.1
N$10
  Top 0.254: IC2.21 65.13,31.61 65.13,31.09 70.28,31.06 | 70.28,31.06 70.47,31.06 | R14.2 70.28,31.37 70.28,31.06
N$11  (via drill 0.6)
  Top 0.254: IC2.85 49.48,21.87 50.62,21.87 v50.62,21.82 | v37.9,14.68 34.06,14.71 J7.5
  Bottom 0.254: v50.62,21.82 51.26,21.82 51.26,25.65 37.85,25.65 v37.9,14.68
N$12
  Top 0.254: IC2.98 56.01,19.86 56.01,18.39 60.58,18.39 60.66,17.78 60.66,17.25 71.3,6.63 71.58,6.4 72.21,5.77 72.21,5.38 74.07,5.38 IC7.11
N$13
  Top 0.254: IC2.99 56.46,19.86 56.46,18.82 61.7,18.82 61.7,17.12 72.85,5.97 75.03,5.97 75.36,5.64 75.36,3.81 IC7.12
N$15
  Top 0.508: IC7.4 76.71,10.03 C30.2
N$16
  Top 0.508: C30.1 75.34,12.45 IC7.5
N$17
  Top 0.508: IC7.1 81.43,10.95 C32.1
N$18
  Top 0.152: C32.2 83.16,13.33 83.16,13.49 83.03,13.72
  Top 0.508: IC7.3 77.98,10.03 77.98,14.6 76.96,15.57 76.96,16.89 77.57,17.4 82.19,17.4 83.03,16.61 83.03,13.72
N$19
  Top 0.508: C29.2 74.07,11.46 IC7.6
N$20
  Top 0.508: C31.1 79.15,12.75 IC7.2
N$22
  Top 0.254: IC2.60 40.41,29.11 R10.1
N$23  (via drill 0.6)
  Top 0.254: v48.26,21.95 47.98,21.95 IC2.82
  Bottom 0.254: J7.1 41.55,16 41.55,19.66 40.59,19.66 40.59,22.58 44.83,22.58 44.83,20.14 48.26,20.14 v48.26,21.95
NTRST  (via drill 0.6)
  Top 0.254: J5.2 74.24,31.37 74.24,30.23 71.91,30.23 v71.91,29.87 | v54.86,27.38 56.16,27.38 56.16,23.9 57.07,23.9 57.07,23.11 IC2.4
  Bottom 0.254: v71.91,29.87 62.84,29.87 62.84,31.06 54.86,31.06 v54.86,27.38
P2_9  (via drill 0.6)
  Top 0.254: IC2.64 53.19,27.11 v53.19,31.7 | v83.97,34.85 80.82,34.85 R5.1
  Bottom 0.254: v53.19,31.7 72.8,31.7 72.8,35.08 82.12,35.13 83.97,35.13 v83.97,34.85 83.92,35.2
PWM1  (via drill 0.6)
  Top 0.254: IC6.23 49.38,11.24 v49.78,18.44 | v49.3,24.59 43.23,24.59 IC2.69
  Bottom 0.254: v49.78,18.44 49.25,18.34 v49.3,24.59
PWM2  (via drill 0.6)
  Top 0.254: IC6.15 54.58,11.24 v54.84,16.28 | v54.58,25.5 48.16,25.5 48.16,25.07 43.2,25.12 IC2.68
  Bottom 0.254: v54.84,16.28 54.79,22.48 54.1,22.48 54.1,25.5 v54.58,25.5
PWM3  (via drill 0.6)
  Top 0.254: IC5.23 28.22,15.7 28.7,16.18 28.7,19.61 v27.84,20.47 | v52.48,33.68 IC2.35
  Bottom 0.254: v27.84,20.47 27.84,34.57 27.91,34.65 51.51,34.65 v52.48,33.68
PWM4  (via drill 0.6)
  Top 0.254: IC5.15 24.51,10.5 v24.51,10.46 | v51.23,33.05 51.48,33.05 IC2.37
  Bottom 0.254: v24.51,10.46 23.42,10.46 23.5,15.87 31.65,15.82 31.57,18.64 31.62,18.69 31.62,34.16 51.23,34.16 v51.23,33.05
RST  (via drill 0.6)  (1 unrouted)
  Top 0.254: IC2.17 60.53,29.61 | 60.53,29.62 60.53,29.61 | 60.53,28.55 v60.53,28.5 | v71.37,25.43 71.4,25.43 v71.4,16.03 | 60.53,29.61 60.53,28.55 | R1.1 63.81,30.23 63.81,29.11 62.46,29.11 62.33,28.98 60.53,28.55
  Bottom 0.254: v60.53,28.5 66.95,28.4 66.95,26.14 71.37,26.14 v71.37,25.43 | v71.4,16.03 75.69,16.03 J5.8
RTCK  (via drill 0.6)
  Top 0.254: IC2.100 57.02,19.9 57,21.23 56.36,21.87 v56.36,22.28
  Bottom 0.254: v56.36,22.28 56.31,23.06 66.47,23.06 66.45,22.94 72.7,22.91 72.7,23.06 74.47,21.21 J5.6
RX3  (via drill 0.6)
  Top 0.254: IC2.6 60.02,24.1 60.22,24.16 60.22,24.51 60.33,24.64 62.59,24.64 63.3,23.85 v63.32,21.46
  Bottom 0.254: v63.32,21.46 67.01,21.46 CN1.2
RXD1  (via drill 0.6)
  Top 0.152: IC7.9 71.45,3.86 71.45,4.32 71.43,4.44
  Top 0.254: IC2.74 45.01,22.11 45.01,23.49 45.34,23.65 v55.37,23.7 | 71.43,4.44 71.43,5.51 70.94,5.99 70.74,6.17 v59.56,17.47
  Bottom 0.254: v55.37,23.7 55.45,19.81 56.67,19.81 56.67,19.74 v59.56,17.47
SER1_RX  (via drill 0.6)
  Top 0.254: IC7.13 v76.61,5.71
  Bottom 0.254: v76.61,5.71 81.18,5.71 81.18,14.6 92.35,14.6 J6.2
SER1_TX  (via drill 0.6)
  Top 0.254: IC7.14 77.85,3.78 77.85,5.87 82.42,5.87 v82.42,5.71 | v82.8,9.47 84.4,9.47 v84.4,16.94
  Bottom 0.254: v82.42,5.71 82.8,5.71 v82.8,9.47 | v84.4,16.94 92.35,16.94 J6.3
SER2_RX  (via drill 0.6)
  Top 0.508: IC7.8 71.63,9.93 71.55,9.85 71.55,8.33 73.03,6.86 78.54,6.86 78.56,7.06 87.78,7.06 87.76,7.49 v87.76,11.48
  Bottom 0.508: v87.76,11.48 88.32,11.76 J6.1
SER2_TX  (via drill 0.6)
  Top 0.508: IC7.7 72.9,9.83 72.9,8 73.13,7.77 85.32,7.77 v85.32,12.95
  Bottom 0.508: v85.32,12.95 85.22,13.13 J6.6
STBY  (via drill 0.6)
  Top 0.254: IC2.93 53.52,18.19 52.08,15.7 IC6.19 52.04,11.24 v52.15,9.4 | v38.53,9.47 35.97,9.47 35.97,9.45 35.51,9.45 v35.51,9.55 | v28.91,12.8 28.63,13.06 26.61,13.06 IC5.19 26.61,13.13
  Bottom 0.254: v52.15,9.4 38.53,9.37 v38.53,9.47 | v35.51,9.55 28.91,9.55 v28.91,12.8
T_RTCK
  Top 0.254: IC2.57 29.92,30.61 29.92,38.84 37.36,38.84 37.36,42.27 J1.6
  Top 0.508: J2.6 37.36,45.54 37.36,42.27
T_SRST
  Top 0.254: IC2.56 30.86,31.11 30.84,37.92 39.22,37.92 39.24,39.75 42.44,39.75 J1.8
  Top 0.508: J2.8 42.44,45.54 J1.8
T_SWDCLK  (via drill 0.6)
  Top 0.254: IC2.62 45.52,28.11 v45.52,29.46 | v36.93,29.77 29.36,29.92 29.31,39.42 34.8,39.47 J1.5
  Top 0.508: J1.5 34.87,42.85 J2.5
  Bottom 0.254: v45.52,29.46 44.4,29.46 44.4,28.12 36.88,28.14 v36.93,29.77
T_SWDIO  (via drill 0.6)
  Top 0.254: IC2.61 41.68,28.61 41.68,27.91 40.41,27.91 R10.2 39.17,27.76 39.17,27.79 35.48,27.79 35.43,28.73 28.27,28.73 28.27,41 28.5,41 v28.5,44.25
  Top 0.508: J2.4 32.28,45.54 J1.4
  Bottom 0.254: v28.5,44.25 32.21,44.27 J1.4
T_SWO
  Top 0.254: J2.7 39.98,45.54 39.98,46.84 45.48,46.84 IC2.49
  Top 0.508: J1.7 39.95,42.85 J2.7
T_TDI
  Top 0.254: IC2.58 43.31,30.11 43.31,30.1 38.15,30.05 38.15,28.57 36.04,28.57 36.04,29.21 35.94,29.21 28.85,29.16 28.8,40 29.79,40 J1.3
  Top 0.508: J2.3 30.56,45.54 30.56,45.14 30.53,45.14 30.53,42.77 29.74,42.77 J1.3
T_TRST
  Top 0.254: IC2.63 42.11,27.61 42.11,27 35,27.03 35,28.22 27.69,28.22 27.69,34.65 27.2,34.65 J1.2
  Top 0.508: J2.2 26.42,45.54 26.42,42.72 27.2,42.72 J1.2
TCK  (via drill 0.6)
  Top 0.254: v60.99,23.82 60.97,23.61 IC2.5
  Bottom 0.254: J5.5 75.31,24.13 69.19,24.13 69.19,25.3 66.57,25.3 66.37,25.15 66.32,23.85 66.04,23.57 60.96,23.6 60.96,23.82 v60.99,23.82
TDI  (via drill 0.6)
  Top 0.254: IC2.2 58.77,22.1 61.49,22.07 v61.49,22.25 | J5.3 69.95,28.83 69.95,22.73 65.46,22.73 v65.46,22.3
  Bottom 0.254: v61.49,22.25 v65.46,22.3
TDO  (via drill 0.6)
  Top 0.254: IC2.1 58.73,21.59 62.15,21.44 62.36,21.26 v62.36,20.29
  Bottom 0.254: v62.36,20.29 72.85,20.29 74.47,18.67 J5.7
TMS  (via drill 0.6)
  Top 0.254: J5.4 70.51,26.29 70.51,17.91 64.64,17.83 v64.49,18.01 | v59.87,20.47 57.48,20.65 57.43,22.61 58.7,22.61 IC2.3
  Bottom 0.254: v64.49,18.01 61.95,19.05 59.77,20.47 59.79,20.62 v59.87,20.47
TX3  (via drill 0.6)
  Top 0.254: IC2.7 57.02,24.58 v57,25.22 | v65.41,24.36 67.56,24.26 CN1.3
  Bottom 0.254: v57,25.22 63.75,25.22 63.75,24.33 v65.41,24.36
TXD1  (via drill 0.6)
  Top 0.254: IC7.10 72.8,2.21 72.59,2.01 70.13,2.01 69.95,2.18 69.95,5.54 70,5.59 70,5.66 63.37,12.29 57.56,12.29 v57.23,12.62 | v41.68,21.39 43.01,21.39 IC2.75
  Bottom 0.254: v57.23,12.62 47.14,12.62 47.07,12.55 44.22,12.55 43.23,13.54 43.23,19.84 v41.68,21.39
VCC  (via drill 0.6)
  Top 0.152: C6.1 21.97,32.33
  Top 0.254: 73.2,31.27 73.2,31.37 | 73.2,31.37 v73.2,35.86 | R14.1 73.2,31.37
  Top 0.406: IC1.2 21.97,32.33 24.05,32.33 C8.1 | IC4.2 24.18,26.24 C7.1
  Top 0.508: J3.1 90.27,36.22 C15.2 90.25,34.11 90.25,25.15 88.72,25.15 IC3.3 | IC3.3 88.7,6.35 84.02,6.35 84.05,3.61 82.35,3.61 | 82.35,3.61 C33.2 | 82.35,3.61 80.42,3.61 IC7.16 | IC3.3 90.14,25.65 v90.14,23.82 | v26.34,27.69 24.18,27.69 C7.1 | C8.1 v26.24,32.21
  Bottom 0.508: v90.14,23.82 88.72,23.82 88.72,35.81 v73.2,35.86 26.64,35.81 26.24,35.64 v26.24,32.21 v26.34,27.69
VDD  (via drill 0.6)
  Top 0.152: 65.63,3.96 65.56,3.96 | 65.63,3.96 IR.2 | 65.63,3.96 65.76,3.73
  Top 0.254: IC2.96 54.99,17.22 55.68,17.17 55.68,15.42 57.28,15.44 57.28,15.52 | C25.1 48.34,15.8 48.34,18.03 48.98,18.03 IC2.84 | IC2.71 39.24,23.61 C19.2 | v48.49,38.35 48.98,38.35 IC2.42 | IC2.28 56.01,35.36 56.01,39.24 56.92,39.24 C2.2 58.19,39.06 58.17,39.09 58.52,39.09 | 60.22,40.36 C3.2 60.22,39.09 58.52,39.09 | IC2.19 61.37,30.61 | 61.37,30.61 61.76,30.61 61.76,30.33 | J5.1 J5.16 | 58.52,39.09 v58.52,38.35 | IC2.12 60.53,27.1 60.53,27.66 60.63,27.66 62.48,27.69 63.3,27.81 | IC2.10 57.51,26.11 57.51,27.1 IC2.12 | IC2.12 | C12.2 66.83,28.6 v68.4,28.6 | IC5.20 29.97,13.75 29.97,12.32 32.54,12.32 | 32.74,12.06 36.64,12.32 36.64,12.49 | IC2.54 41.45,32.11 41.45,33.78 40.28,33.78 C10.1 | R12.2 48.84,47.12 48.84,42.19 48.54,42.19 C1.2 | 61.37,30.61 61.37,30.23 R1.2 62.05,30.23 62.05,31.17 64.62,31.17 64.62,28.42
  Top 0.406: 61.44,1 61.44,9.07 C27.2 58.62,9.04 57.56,9.04 57.56,5.54 v58.27,5.54 | IC6.20 51.41,11.24 51.31,9.98 50.44,9.98 v50.44,8.56
  Top 0.508: C21.2 86.33,18.67 C20.2 | C20.2 86.44,22.45 IC3.2 | IC3.2 IC3.TER 86.59,32 | 86.59,32 86.59,16.71 86.49,16.71 v86.49,8.89 | v95.83,8.94 97.46,8.99 97.49,0.96 65.76,0.96 | 65.76,0.96 61.44,1 36.73,1.17 36.6,1.57 v37.31,2.26 | v37.29,11.81 36.68,11.61 | J7.6 36.64,12.49 36.68,11.61 | 36.68,11.61 41.76,11.61 J7.8 | 65.76,3.73 65.76,0.96 | 63.23,27.76 63.3,27.81 C11.2 64.62,28.42 68.4,28.42 v68.4,28.6 | C26.1 57.28,15.52 v58.45,15.52 58.45,14.27 v58.34,14.27 | v82.73,33.88 85.9,33.88 | 86.59,32 86.59,33.88 85.9,33.88 | 85.9,33.88 Q1.2 | 48.72,40.84 C1.2 48.49,40.84 v48.49,38.35 | v75.82,38.35 75.69,38.35 J5.1 | C25.1 48.39,15.8 v48.39,14.27 | C28.2 65.56,7.01 65.56,3.96 65.56,3.4 | C19.2 39.24,22.89 C18.2 26.64,22.89 26.64,20.57 25.83,20.57 v25.83,20.47 25.83,20.78 | C9.1 35.38,34.8 39.7,34.8 39.7,33.76 C10.1 40.21,33.76 v40.21,38.66 | C20.2 86.44,22.55 IC3.2 | C22.2 32.79,11.2 32.74,11.2 32.74,12.06 | 32.54,12.32 32.74,12.06 | 32.74,12.06 35.33,12.06 v35.33,11.84 | v35.36,23.42 35.33,23.42 35.33,22.94
  Bottom 0.152: IR.2 65.58,3.73
  Bottom 0.254: J5.1 74.09,33.91 74.09,33.27
  Bottom 0.406: v50.44,8.56 58.27,8.56 v58.27,5.54
  Bottom 0.508: v86.49,8.89 94.29,8.94 v95.83,8.94 | v37.31,2.26 v37.29,11.81 | v58.45,15.52 61.49,15.52 61.49,10.44 62.94,10.44 62.94,8.61 65.66,8.61 65.58,3.73 | v68.4,28.6 73.89,28.6 73.89,28.7 74.09,28.7 74.09,33.27 74.09,34.09 82.73,34.09 v82.73,33.88 | v75.82,38.35 v58.52,38.35 v48.49,38.35 48.49,38.66 v40.21,38.66 22.78,38.66 22.78,20.47 v25.83,20.47 | v48.39,14.27 v58.34,14.27 | v35.33,11.84 v35.36,23.42

### Text on the board
Bottom: TWI 9/15
tNames: Target | JTAG | CAN | Serial | ESP-01 | MOTOR